# EAGLE design mm8_D016Aoshw (EAGLE 7.5.0)
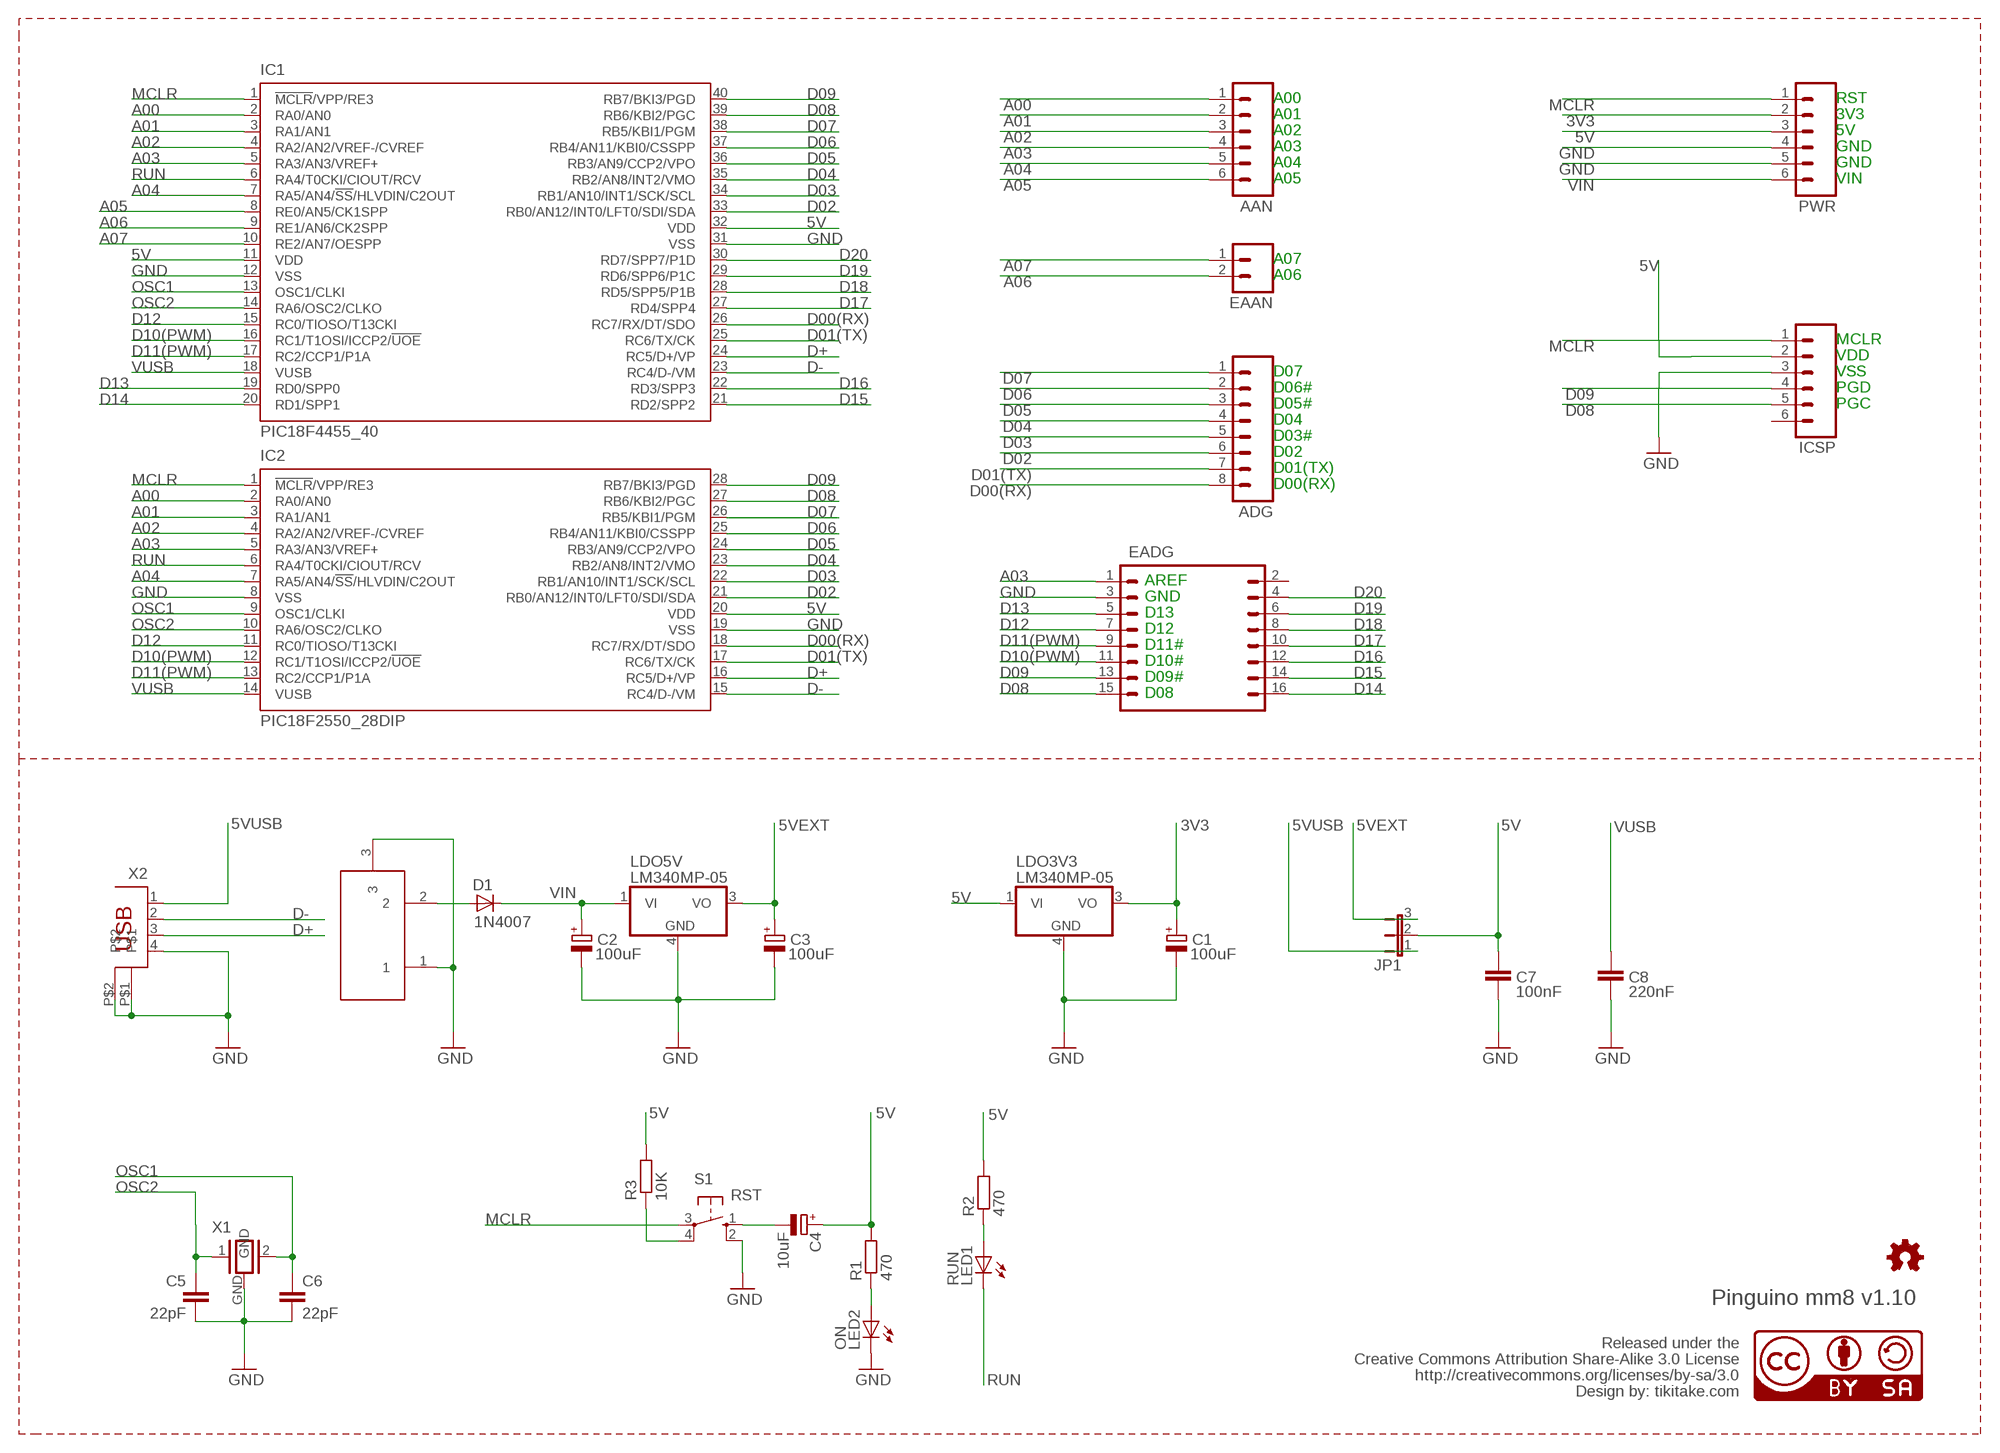
[diagram p0: schematic, sheet 1]

## Parts
AAN  M06SIP  [1X06]
ADG  M08  [1X08]
C1  100uF  CPOL-EUE2-5  [E2-5]
C2  100uF  CPOL-EUE2-5  [E2-5]
C3  100uF  CPOL-EUE2-5  [E2-5]
C4  10uF  CPOL-EUE2-5  [E2-5]
C5  22pF  C5/2.5N  [C5B2.5N]
C6  22pF  C5/2.5N  [C5B2.5N]
C7  100nF  C5/2.5N  [C5B2.5N]
C8  220nF  C5/2.5N  [C5B2.5N]
D1  1N4007  DIODE7  [DO41-7]
EAAN  M02PTH  [1X02]
EADG  M08X2  [2X8]
IC1  PIC18F4455_40  [DIL40]
IC2  PIC18F2550_28DIP  [DIL28-3]
ICSP  M06SIP  [1X06]
JP1  JP2E  [JP2]
LDO3V3  LM340MP-05  [SOT223]
LDO5V  LM340MP-05  [SOT223]
LED1  RUN  LED3MM  [LED3MM]
LED2  ON  LED3MM  [LED3MM]
LOGO1  OSHW_LOGO_FILLX0150-NT  [OSHW_FILLX150_NOTEXT]
PWR  M06SIP  [1X06]
R1  470  RESISTOR  [0207/7]
R2  470  RESISTOR  [0207/7]
R3  10K  RESISTOR  [0207/7]
S1  RST  10-XX  [B3F-10XX]
U$3  CC-BY-SA  [CC-BY-SA]
X1  RESONATOR  [QS3]
X2  PN61729  [PN61729]
X4  DC21MMX  [DC-21MM]

## Nets
3V3: C1.+ LDO3V3.3(VO) PWR.2
5V: C4.+ C7.1 IC1.11(VDD) IC1.32(VDD) IC2.20(VDD) ICSP.2 JP1.2 LDO3V3.1(VI) PWR.3 R1.2 R2.2 R3.2
5VEXT: C3.+ JP1.3 LDO5V.3(VO)
5VUSB: JP1.1 X2.1
A00: AAN.1 IC1.2(RA0/AN0) IC2.2(RA0/AN0)
A01: AAN.2 IC1.3(RA1/AN1) IC2.3(RA1/AN1)
A02: AAN.3 IC1.4(RA2/AN2/VREF-/CVREF) IC2.4(RA2/AN2/VREF-/CVREF)
A03: AAN.4 EADG.1 IC1.5(RA3/AN3/VREF+) IC2.5(RA3/AN3/VREF+)
A04: AAN.5 IC1.7(RA5/AN4/!SS!/HLVDIN/C2OUT) IC2.7(RA5/AN4/!SS!/HLVDIN/C2OUT)
A05: AAN.6 IC1.8(RE0/AN5/CK1SPP)
A06: EAAN.2 IC1.9(RE1/AN6/CK2SPP)
A07: EAAN.1 IC1.10(RE2/AN7/OESPP)
D00(RX): ADG.8 IC1.26(RC7/RX/DT/SDO) IC2.18(RC7/RX/DT/SDO)
D01(TX): ADG.7 IC1.25(RC6/TX/CK) IC2.17(RC6/TX/CK)
D02: ADG.6 IC1.33(RB0/AN12/INT0/LFT0/SDI/SDA) IC2.21(RB0/AN12/INT0/LFT0/SDI/SDA)
D03: ADG.5 IC1.34(RB1/AN10/INT1/SCK/SCL) IC2.22(RB1/AN10/INT1/SCK/SCL)
D04: ADG.4 IC1.35(RB2/AN8/INT2/VMO) IC2.23(RB2/AN8/INT2/VMO)
D05: ADG.3 IC1.36(RB3/AN9/CCP2/VPO) IC2.24(RB3/AN9/CCP2/VPO)
D06: ADG.2 IC1.37(RB4/AN11/KBI0/CSSPP) IC2.25(RB4/AN11/KBI0/CSSPP)
D07: ADG.1 IC1.38(RB5/KBI1/PGM) IC2.26(RB5/KBI1/PGM)
D08: EADG.15 IC1.39(RB6/KBI2/PGC) IC2.27(RB6/KBI2/PGC) ICSP.5
D09: EADG.13 IC1.40(RB7/BKI3/PGD) IC2.28(RB7/BKI3/PGD) ICSP.4
D10(PWM): EADG.11 IC1.16(RC1/T1OSI/ICCP2/!UOE) IC2.12(RC1/T1OSI/ICCP2/!UOE)
D11(PWM): EADG.9 IC1.17(RC2/CCP1/P1A) IC2.13(RC2/CCP1/P1A)
D12: EADG.7 IC1.15(RC0/TIOSO/T13CKI) IC2.11(RC0/TIOSO/T13CKI)
D13: EADG.5 IC1.19(RD0/SPP0)
D14: EADG.16 IC1.20(RD1/SPP1)
D15: EADG.14 IC1.21(RD2/SPP2)
D16: EADG.12 IC1.22(RD3/SPP3)
D17: EADG.10 IC1.27(RD4/SPP4)
D18: EADG.8 IC1.28(RD5/SPP5/P1B)
D19: EADG.6 IC1.29(RD6/SPP6/P1C)
D20: EADG.4 IC1.30(RD7/SPP7/P1D)
D+: IC1.24(RC5/D+/VP) IC2.16(RC5/D+/VP) X2.3
D-: IC1.23(RC4/D-/VM) IC2.15(RC4/D-/VM) X2.2
GND: C1.- C2.- C3.- C5.2 C6.2 C7.2 C8.2 EADG.3 IC1.12(VSS) IC1.31(VSS) IC2.8(VSS) IC2.19(VSS) ICSP.3 LDO3V3.4(GND) LDO5V.4(GND) LED2.K(C) PWR.4 PWR.5 S1.2(S1) X1.GND X2.4 X2.P$1 X2.P$2 X4.1 X4.3
MCLR: IC1.1(!MCLR!/VPP/RE3) IC2.1(!MCLR!/VPP/RE3) ICSP.1 PWR.1 S1.3(P)
N$1: LED2.A R1.1
N$2: R3.1 S1.4(P1)
N$3: D1.A X4.2
N$4: LED1.A R2.1
N$5: C4.- S1.1(S)
OSC1: C6.1 IC1.13(OSC1/CLKI) IC2.9(OSC1/CLKI) X1.2
OSC2: C5.1 IC1.14(RA6/OSC2/CLKO) IC2.10(RA6/OSC2/CLKO) X1.1
RUN: IC1.6(RA4/T0CKI/CIOUT/RCV) IC2.6(RA4/T0CKI/CIOUT/RCV) LED1.K(C)
VIN: C2.+ D1.C LDO5V.1(VI) PWR.6
VUSB: C8.1 IC1.18(VUSB) IC2.14(VUSB)
Unconnected: EADG.2 ICSP.6

## Notes on the sheet
- A00 | RST
- A01 | 3V3
- A02 | 5V
- A03 | GND
- A04 | GND
- A05 | VIN
- A07
- A06
- MCLR
- VDD
- D07 | VSS
- D06# | PGD
- D05# | PGC
- D04
- D03#
- D02
- D01(TX)
- D00(RX)
- AREF
- GND
- D13
- D12
- D11#
- D10#
- D09#
- D08
- Pinguino mm8 v1.10
- Released under the
- Creative Commons Attribution Share-Alike 3.0 License
- http://creativecommons.org/licenses/by-sa/3.0
- Design by: tikitake.com

## Library data of the parts
AAN ICSP PWR = mp8_001:M06: Header 6 Standard 6-pin 0.1" header. Use with straight break away headers (SKU : PRT-00116), right angle break away headers (PRT-00553), swiss pins (PRT-00743), machine pins (PRT-00117), and female headers (PRT-00115). Molex polarized connector foot print use with SKU : PRT-08094 with associated crimp pins and housings. NOTES ON THE VARIANTS LOCK and LOCK_LONGPADS... This footprint was designed to help hold the alignment of a through-hole component (i.e. 6-pin header) while soldering it into place. You may notice that each hole has been shifted either up or down by 0.005 of an inch from it's more standard position (which is a perfectly straight line). This slight alteration caused the pins (the squares in the middle) to touch the edges of the holes. Because they are alternating, it causes a "brace" to hold the component in place. 0.005 has proven to be the perfect amount of "off-center" position when using our standard breakaway headers. Although looks a little odd when you look at the bare footprint, once you have a header in there, the alteration is very hard to notice. Also, if you push a header all the way into place, it is covered up entirely on the bottom side. This idea of altering the position of holes to aid alignment will be further integrated into the Sparkfun Library for other footprints. It can help hold any component with 3 or more connection pins.
ADG = mp8_001:M08: Header 8 Standard 8-pin 0.1" header. Use with straight break away headers (SKU : PRT-00116), right angle break away headers (PRT-00553), swiss pins (PRT-00743), machine pins (PRT-00117), and female headers (PRT-00115).
C1-C3 = n00b0t_002:CPOL-EU: POLARIZED CAPACITOR, European symbol
C4 = n00b0t_004:CPOL-EU: POLARIZED CAPACITOR, European symbol
C5 C6 = n00b0t_004:C: WIMA CAPACITOR naming: grid - package width
C7 C8 = n00b0t_002:C: WIMA CAPACITOR naming: grid - package width
D1 = mm8_001:DIODE: DIODE general purpose rectifier, 1 A
EAAN = mp8_001:M02: Header 2 Standard 2-pin 0.1" header. Use with straight break away headers (SKU : PRT-00116), right angle break away headers (PRT-00553), swiss pins (PRT-00743), machine pins (PRT-00117), and female headers (PRT-00115). Molex polarized connector foot print use with SKU : PRT-08233 with associated crimp pins and housings.
EADG = mm8_001:M08X2
IC1 = p8aff_001:PIC18F4*_40: USB Microcontrollers with nanoWatt Technology High-Performance, Enhanced Flash, 28/40/44-Pin, Source: http://ww1.microchip.com/downloads/en/devicedoc/39632c.pdf
IC2 = p8aff_001:PIC18F2*_28: USB Microcontrollers with nanoWatt Technology High-Performance, Enhanced Flash, 28/40/44-Pin, Source: http://ww1.microchip.com/downloads/en/devicedoc/39632c.pdf
JP1 = mm8_001:JP2E: JUMPER
LDO3V3 LDO5V = mm8_001:LM340?-*: Positive VOLTAGE REGULATOR Source: http://cache.national.com/ds/LM/LM340.pdf
LED1 LED2 = n00b0t_004:LED
LOGO1 = tikitake_002:OSHW_LOGO_FILL
R1-R3 = n00b0t_004:RESISTOR
S1 = n00b0t_004:10-XX: OMRON SWITCH
U$3 = n00b0t_004:CC-BY-SA
X1 = special:RESONATOR
X2 = SmartPrj:PN61729: BERG USB connector
X4 = powersupply:DC21MM

## Net classes
0 default: width 0.152 mm, drill 0.305 mm, clearance 0.152 mm
1 power: width 0.61 mm, drill 0.508 mm, clearance 0.152 mm
2 gnd: width 0.305 mm, drill 0.508 mm, clearance 0.152 mm
3 usbvcc: width 0.508 mm, drill 0.508 mm, clearance 0.152 mm

## Board
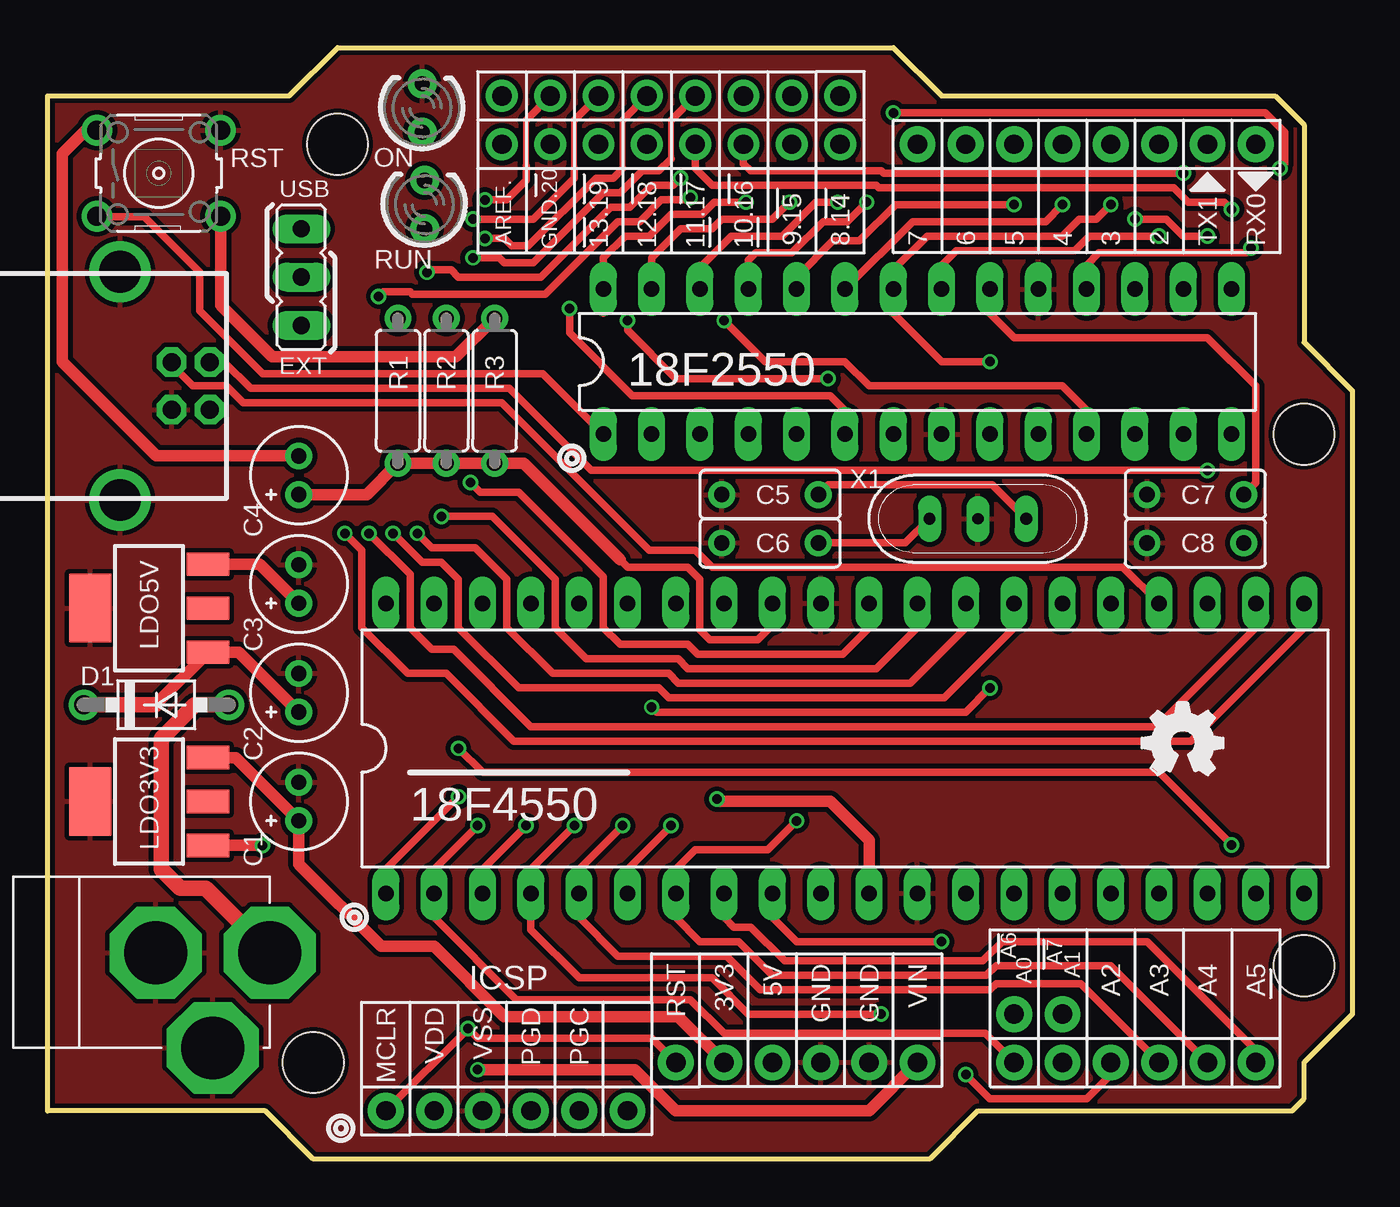
[diagram p1: board, top side]
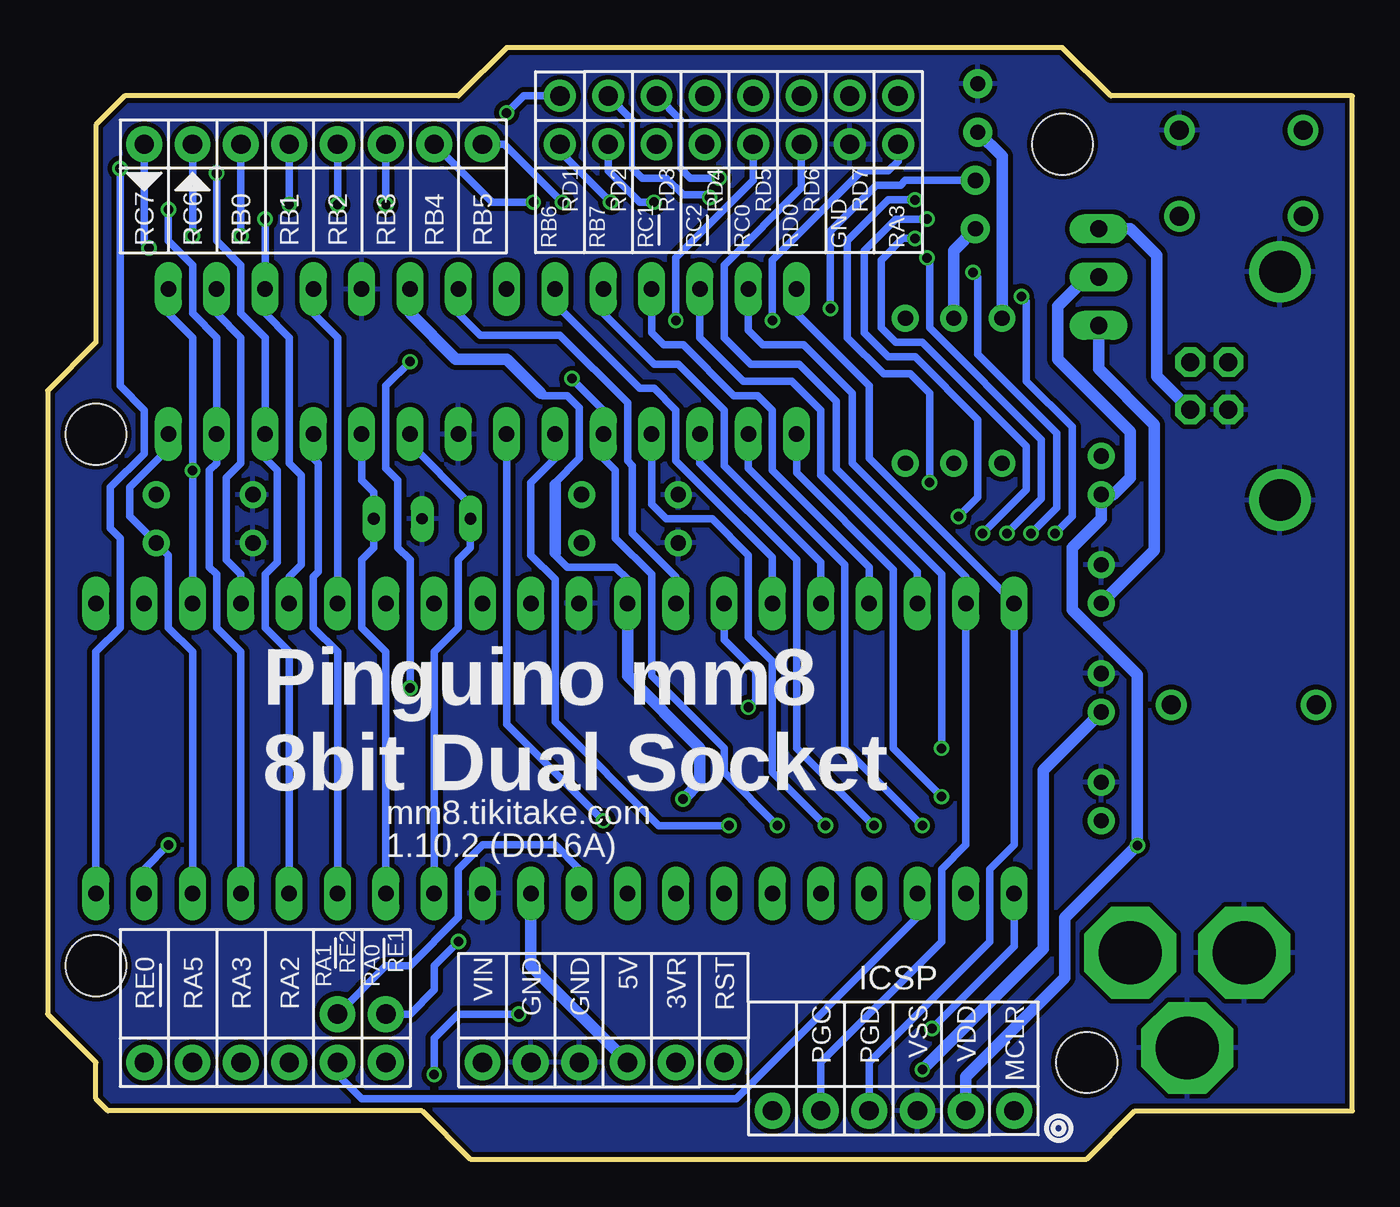
[diagram p2: board, bottom side, seen from below]

Size 68.58 x 58.42 mm. Coordinates in mm from the lower left corner, seen from the top.
Outline: 12.7,55.88 15.24,58.42 44.45,58.42 46.99,55.88 64.52,55.88 66.04,54.36 66.04,42.93 68.58,40.39 68.58,7.62 66.04,5.08 66.04,3.17 65.41,2.54 48.9,2.54 46.35,0 13.97,0 11.43,2.54 0,2.54 0,55.88 12.7,55.88
Copper layers (1*16): Top 0.035mm / dielectric 1.5mm / Bottom 0.035mm
Design rules "mm8_B001 *": minimum track width 8mil, minimum drill 12mil, track to track 10mil, track to pad 10mil, pad to pad 10mil, via to via 10mil, smd to smd 0mil, copper to edge 10mil, drill to drill 10mil, minimum pad ring 12mil, minimum via ring 6mil, stop-mask expansion 2mil, vias tented up to drill 25mil, thermal gap 10mil
Holes 3.2 mm at 66.04,38.1 66.04,10.16 15.24,53.34 13.97,5.08

### Footprints (pad centres in the part's own frame; a part is rotated, then mirrored left to right if it is on the bottom)
1X06 = drill 1.016 pad 1.88: 1 0,0; 2 2.54,0; 3 5.08,0; 4 7.62,0; 5 10.16,0; 6 12.7,0
1X08 = drill 1.016 pad 1.88: 1 0,0; 2 2.54,0; 3 5.08,0; 4 7.62,0; 5 10.16,0; 6 12.7,0; 7 15.24,0; 8 17.78,0
E2-5 = drill 0.8: + -1.016,0; - 1.016,0
C5B2.5N = drill 0.8: 1 -2.54,0; 2 2.54,0
DO41-7 = drill 1: A 3.81,0; C -3.81,0
1X02 = drill 1.016 pad 1.88: 1 0,0; 2 2.54,0
2X8 = drill 1.016 pad 1.676: 1 0,0; 2 0,2.54; 3 2.54,0; 4 2.54,2.54; 5 5.08,0; 6 5.08,2.54; 7 7.62,0; 8 7.62,2.54; 9 10.16,0; 10 10.16,2.54; 11 12.7,0; 12 12.7,2.54; 13 15.24,0; 14 15.24,2.54; 15 17.78,0; 16 17.78,2.54
DIL40 = drill 0.813 long: 1 -24.13,-7.62; 2 -21.59,-7.62; 3 -19.05,-7.62; 4 -16.51,-7.62; 5 -13.97,-7.62; 6 -11.43,-7.62; 7 -8.89,-7.62; 8 -6.35,-7.62; 9 -3.81,-7.62; 10 -1.27,-7.62; 11 1.27,-7.62; 12 3.81,-7.62; 13 6.35,-7.62; 14 8.89,-7.62; 15 11.43,-7.62; 16 13.97,-7.62; 17 16.51,-7.62; 18 19.05,-7.62; 19 21.59,-7.62; 20 24.13,-7.62; 21 24.13,7.62; 22 21.59,7.62; 23 19.05,7.62; 24 16.51,7.62; 25 13.97,7.62; 26 11.43,7.62; 27 8.89,7.62; 28 6.35,7.62; 29 3.81,7.62; 30 1.27,7.62; 31 -1.27,7.62; 32 -3.81,7.62; 33 -6.35,7.62; 34 -8.89,7.62; 35 -11.43,7.62; 36 -13.97,7.62; 37 -16.51,7.62; 38 -19.05,7.62; 39 -21.59,7.62; 40 -24.13,7.62
DIL28-3 = drill 0.813 long: 1 -16.51,-3.81; 2 -13.97,-3.81; 3 -11.43,-3.81; 4 -8.89,-3.81; 5 -6.35,-3.81; 6 -3.81,-3.81; 7 -1.27,-3.81; 8 1.27,-3.81; 9 3.81,-3.81; 10 6.35,-3.81; 11 8.89,-3.81; 12 11.43,-3.81; 13 13.97,-3.81; 14 16.51,-3.81; 15 16.51,3.81; 16 13.97,3.81; 17 11.43,3.81; 18 8.89,3.81; 19 6.35,3.81; 20 3.81,3.81; 21 1.27,3.81; 22 -1.27,3.81; 23 -3.81,3.81; 24 -6.35,3.81; 25 -8.89,3.81; 26 -11.43,3.81; 27 -13.97,3.81; 28 -16.51,3.81
JP2 = drill 0.914 long: 1 -2.54,0; 2 0,0; 3 2.54,0
SOT223 = smd 1.219 x 2.235: 1 -2.311,-3.099; 2 0,-3.099; 3 2.311,-3.099 | smd 3.6 x 2.2: 4 0,3.099
LED3MM = drill 0.8 pad 1.524: A -1.27,0; K 1.27,0
0207/7 = drill 0.8: 1 -3.81,0; 2 3.81,0
B3F-10XX = drill 1: 1 -3.251,2.261; 2 3.251,2.261; 3 -3.251,-2.261; 4 3.251,-2.261
QS3 = drill 0.61 long: 1 -2.54,0; 2 2.54,0 | drill 0.6 long: GND 0,0
PN61729 = drill 0.95 octagon: 1 1.25,4.71; 2 -1.25,4.71; 3 -1.25,2.71; 4 1.25,2.71 | drill 2.2: P$1 -6,0; P$2 6,0
DC-21MM = drill 3.302 pad 4.826 octagon: 1 -5.08,-3.353; 2 -0.076,-6.35; 3 -0.076,-0.356

### Placement (x,y rotation side)
AAN  50.8,5.08 0 top
ADG  45.72,53.34 0 top
C1  13.21,18.8 90 top
C2  13.21,24.51 90 top
C3  13.21,30.23 90 top
C4  13.21,35.94 90 top
C5  37.97,34.92 180 top
C6  37.97,32.38 180 top
C7  60.33,34.92 180 top
C8  60.33,32.38 180 top
D1  5.71,23.88 0 top
EAAN  53.34,7.62 180 top
EADG  23.88,53.34 0 top
IC1  41.91,21.59 0 top
IC2  45.72,41.91 0 top
ICSP  17.78,2.54 0 top
JP1  13.34,46.35 270 top
LDO3V3  5.33,18.8 90 top
LDO5V  5.33,28.96 90 top
LED1  19.81,50.16 90 top
LED2  19.68,55.24 90 top
LOGO1  57.53,20.19 0 top
PWR  33.02,5.08 0 top
R1  18.41,40.39 270 top
R2  20.95,40.39 270 top
R3  23.5,40.39 270 top
S1  5.84,51.82 0 top
U$3  11.43,-10.16 0 top  (outside the outline)
X1  48.9,33.66 180 top
X2  3.81,40.64 270 top
X4  5.33,10.92 90 top

### Tracks (layer width: path | path; a pad name or v marks a point on that pad's centre or on a via)
3V3
  Top 0.61: PWR.2 33.15,7.49 24,7.49 20.32,11.18 17.53,11.18 13.21,15.49 C1.+ 9.88,21.11 LDO3V3.3
5V  (via drill 0.5)
  Top 0.406: IC2.20 49.53,44.45 50.8,43.18 60.96,43.18 63.5,40.64 63.5,35.56 C7.1 | 30.1,31.5 30.48,31.11 33.66,31.11 34.29,30.48 34.29,27.81 34.8,27.3 37.34,27.3 38.1,28.07
  Top 0.61: v11.3,16.48 LDO3V3.1 | C4.+ 16.76,34.92 R1.2 R2.2 R3.2 25.02,36.58 30.1,31.5 | 38.1,28.07 IC1.32 | v35.18,18.92 35.31,18.8 41.15,18.8 43.18,16.76 IC1.11
  Bottom 0.406: IC1.32 38.1,30.48 38.73,31.11 41.27,31.11 41.91,31.75 41.91,31.88 | 41.91,35.43 41.91,35.56 40.64,36.83 40.64,39.5 41.27,40.13 42.55,40.13 42.67,40.26
  Bottom 0.61: ICSP.2 20.32,4.32 15.11,9.53 15.11,12.68 v11.3,16.48 11.3,25.45 14.73,28.88 14.73,32.13 13.21,33.66 C4.+ 12.57,34.92 11.68,35.81 11.68,38.23 15.49,42.04 15.49,44.83 13.97,46.35 JP1.2 | PWR.3 43.18,10.16 IC1.11 | 41.91,31.88 41.91,35.43 | 42.67,40.26 44.45,42.04 47.12,42.04 49.53,44.45 IC2.20 | IC1.32 38.1,25.4 34.29,21.59 34.29,19.81 v35.18,18.92
5VEXT
  Top 0.61: C3.+ 11.15,31.27 LDO5V.3
  Bottom 0.61: JP1.3 13.34,41.53 10.41,38.61 10.41,32 C3.+
5VUSB
  Bottom 0.61: X2.1 10.29,41.15 10.29,47.5 11.68,48.89 JP1.1
A00  (via drill 0.5)
  Top 0.406: AAN.1 49.28,6.6 35.56,6.6 33.78,8.38 24.64,8.38 20.32,12.7 IC1.2 20.32,15.24 v22.61,17.53
  Bottom 0.406: IC2.2 31.75,36.32 26.67,31.24 26.67,21.59 v22.61,17.53
A01  (via drill 0.5)
  Top 0.406: v25.15,17.53 22.86,15.24 IC1.3
  Bottom 0.406: IC2.3 34.29,36.58 29.21,31.5 29.21,21.59 v25.15,17.53 | IC1.3 22.86,12.7 32.38,3.17 52.07,3.17 53.34,4.45 AAN.2
A02  (via drill 0.5)
  Top 0.406: v27.69,17.53 25.4,15.24 IC1.4 25.4,12.07 27.94,9.53 34.92,9.53 36.83,7.62 v43.81,7.62 | AAN.3 55.88,4.45 54.61,3.17 49.53,3.17 v48.26,4.45
  Bottom 0.406: IC2.4 36.83,34.42 36.07,33.66 33.66,33.66 31.75,31.75 31.75,27.43 30.48,26.16 30.48,20.32 v27.69,17.53 | v48.26,4.45 48.26,6.35 46.99,7.62 v43.81,7.62
A03  (via drill 0.5)
  Top 0.406: v30.23,17.53 27.94,15.24 IC1.5 27.94,12.7 29.97,10.67 35.69,10.67 37.47,8.89 49.53,8.89 49.85,9.21 54.29,9.21 AAN.4 | v30.48,44.07 30.48,43.56 33.02,41.02 v41.02,41.02
  Bottom 0.406: v30.23,17.53 33.02,20.32 33.02,21.59 36.83,25.4 36.83,30.73 38.73,32.64 38.73,36.2 39.37,36.83 IC2.5 39.37,39.37 v41.02,41.02 | EADG.1 23.88,52.45 24.38,51.94 25.78,51.94 30.48,47.24 v30.48,44.07
A04  (via drill 0.5)
  Top 0.406: v39.37,17.78 37.85,16.26 34.04,16.26 33.02,15.24 IC1.7 33.02,12.7 34.29,11.43 36.32,11.43 38.1,9.65 49.34,9.65 49.85,10.16 55.88,10.16 AAN.5
  Bottom 0.406: IC2.7 44.45,22.86 v39.37,17.78
A05
  Top 0.406: IC1.8 35.56,12.7 36.07,12.19 36.96,12.19 38.73,10.41 49.15,10.41 50.16,11.43 57.78,11.43 63.5,5.71 AAN.6
A06  (via drill 0.5)
  Top 0.406: IC1.9 38.1,12.7 39.37,11.43 v46.99,11.43
  Bottom 0.406: v46.99,11.43 48.26,10.16 48.26,8.89 49.53,7.62 EAAN.2
A07
  Bottom 0.406: EAAN.1 50.8,10.16 49.53,10.16 46.99,12.7 46.99,15.24 45.72,16.51 41.91,16.51 40.64,15.24 IC1.10
D00(RX)  (via drill 0.5)
  Top 0.406: IC2.18 54.61,46.99 55.24,47.62 62.99,47.62 v63.25,47.88
  Bottom 0.406: v63.25,47.88 63.5,48.13 ADG.8 | IC1.26 53.34,43.18 54.61,44.45 IC2.18
D01(TX)  (via drill 0.5)
  Top 0.406: v57.15,49.4 58.8,49.4 59.69,48.51 v60.96,48.51
  Bottom 0.406: v57.15,49.4 IC2.17 57.15,44.45 55.88,43.18 55.88,36.58 55.24,35.94 55.24,31.24 55.88,30.61 IC1.25 | v60.96,48.51 ADG.7
D02  (via drill 0.5)
  Top 0.406: IC2.21 46.99,46.99 47.75,47.75 53.98,47.75 54.74,48.51 v58.42,48.51
  Bottom 0.406: v58.42,48.51 ADG.6 | IC1.33 35.56,30.61 37.85,32.89 37.85,36.45 38.1,36.7 38.1,39.75 41.66,43.31 45.85,43.31 46.99,44.45 IC2.21
D03  (via drill 0.5)
  Top 0.406: v55.88,50.16 55.12,49.4 54.23,49.4 53.34,48.51 46.23,48.51 44.45,46.74 IC2.22 44.45,44.45 46.99,41.91 v49.53,41.91 | v31.75,23.75 32,23.49 48.26,23.49 v49.53,24.77
  Bottom 0.406: v55.88,50.16 ADG.5 | IC1.34 33.02,27.3 31.37,25.65 31.37,24.13 v31.75,23.75 | v49.53,24.77 49.53,31.5 50.16,32.13 50.16,35.69 50.8,36.32 50.8,40.64 v49.53,41.91
D04  (via drill 0.5)
  Top 0.406: IC2.23 45.47,49.28 52.45,49.28 v53.34,50.16
  Bottom 0.406: v53.34,50.16 ADG.4 | IC1.35 30.48,31.62 35.56,36.7 35.56,39.37 36.7,40.51 37.47,40.51 41.91,44.96 IC2.23
D05  (via drill 0.5)
  Top 0.406: IC2.24 39.37,46.35 41.27,48.26 42.67,48.26 44.58,50.16 v50.8,50.16
  Bottom 0.406: IC1.36 27.94,31.37 33.02,36.45 33.02,39.37 35.43,41.78 36.7,41.78 39.37,44.45 IC2.24 | v50.8,50.16 ADG.3
D06  (via drill 0.5)
  Top 0.406: IC2.25 36.83,47.24 37.21,47.62 39.12,47.62 40.77,49.28 42.04,49.28 v43.05,50.29
  Bottom 0.406: IC1.37 25.4,31.11 30.48,36.2 30.48,39.37 31.24,40.13 32.51,40.13 35.18,42.8 36.2,42.8 36.83,43.43 IC2.25 | v43.05,50.29 45.21,50.29 ADG.2
D07  (via drill 0.5)
  Top 0.406: IC2.26 34.29,46.99 34.42,46.99 35.94,48.51 38.61,48.51 40.39,50.29 v41.53,50.29
  Bottom 0.406: IC1.38 22.86,30.86 27.94,35.94 27.94,39.37 29.46,40.89 32,40.89 34.29,43.18 IC2.26 | v41.53,50.29 44.58,53.34 ADG.1
D08  (via drill 0.5)
  Top 0.406: IC2.27 31.75,47.37 33.27,48.89 34.92,48.89 35.43,49.4 38.1,49.4 v38.99,50.29
  Bottom 0.406: ICSP.5 27.94,5.08 21.59,11.43 21.59,15.24 20.32,16.51 IC1.39 20.32,30.61 26.29,36.58 26.29,40.26 28.83,42.8 30.99,42.8 31.75,43.56 IC2.27 | v38.99,50.29 41.66,52.96 EADG.15
D09  (via drill 0.5)
  Top 0.406: 29.21,44.45 IC2.28 29.21,47.37 30.35,48.51 31.62,48.51 32.77,49.66 34.42,49.66 35.05,50.29 v36.7,50.29
  Bottom 0.406: ICSP.4 25.4,5.08 19.05,11.43 19.05,15.24 17.78,16.51 IC1.40 25.4,36.83 25.4,40.64 29.21,44.45 IC2.28 | v36.7,50.29 37.47,50.29 39.12,51.94 EADG.13
D10(PWM)  (via drill 0.51)
  Top 0.406: EADG.11 36.58,52.32 36.96,51.94 43.81,51.94 43.94,51.82 v59.69,51.82
  Bottom 0.406: IC1.16 55.88,26.67 57.15,27.94 57.15,30.73 56.52,31.37 56.52,36.2 57.15,36.83 IC2.12 57.15,43.18 58.42,44.45 58.42,46.99 59.69,48.26 v59.69,51.82
D11(PWM)  (via drill 0.5)
  Top 0.406: EADG.9 34.04,52.07 34.92,51.18 43.56,51.18 43.69,51.05 59.18,51.05 59.94,50.29 61.85,50.29 v62.23,49.91
  Bottom 0.406: IC1.17 58.42,26.67 59.69,27.94 59.69,30.73 60.07,31.11 60.07,36.2 59.69,36.58 IC2.13 59.69,43.18 60.96,44.45 60.96,46.99 62.23,48.26 v62.23,49.91
D12  (via drill 0.5)
  Top 0.406: IC2.11 54.61,39.37 53.34,40.64 43.18,40.64 41.91,41.91 37.72,41.91 v35.56,44.07
  Bottom 0.406: IC1.15 53.34,26.67 54.61,27.94 54.61,30.61 54.36,30.86 54.36,36.58 54.61,36.83 IC2.11 | v35.56,44.07 35.56,47.37 31.5,51.44 EADG.7
D13  (via drill 0.5)
  Top 0.406: v62.23,16.51 58.42,20.32 22.86,20.32 v21.59,21.59
  Bottom 0.406: IC1.19 63.5,15.24 v62.23,16.51 | EADG.5 28.96,51.05 33.02,46.99 33.02,43.18 31.62,41.78 29.08,41.78 27.13,39.83 27.13,36.27 21.59,30.73 v21.59,21.59
D14  (via drill 0.5)
  Top 0.406: v64.77,52.07 65.02,52.32 65.02,53.98 64.01,54.99 v44.45,54.99
  Bottom 0.406: EADG.16 43.56,55.88 v44.45,54.99 | IC1.20 66.04,26.67 64.77,27.94 64.77,32.64 65.28,33.15 65.28,35.31 63.5,37.08 63.5,39.37 64.77,40.64 v64.77,52.07
D15  (via drill 0.5)
  Top 0.406: v33.78,50.55 33.66,50.42 32.26,50.42 31.11,49.28 29.97,49.28 26.16,45.47 19.18,45.47 19.05,45.59 17.65,45.59 v17.4,45.34 | IC1.21 66.04,27.94 60.07,21.97 24.51,21.97 20.95,25.53 18.92,25.53 16.51,27.94 16.51,32 v15.62,32.89
  Bottom 0.305: 37.85,52.07 37.85,54.61
  Bottom 0.406: 37.85,54.61 EADG.14 | v33.78,50.55 33.91,50.67 35.18,50.67 36.07,51.56 37.34,51.56 37.85,52.07 | v17.4,45.34 17.14,45.09 17.14,40.89 14.73,38.48 14.73,33.78 v15.62,32.89
D16  (via drill 0.5)
  Top 0.406: v33.27,51.56 32.89,51.18 31.75,51.18 30.61,50.04 29.59,50.04 25.91,46.35 21.59,46.35 21.21,46.74 20.07,46.74 v19.94,46.61 | IC1.22 63.5,27.94 58.29,22.73 25.4,22.73 21.34,26.8 20.19,26.8 19.05,27.94 19.05,30.73 v16.89,32.89
  Bottom 0.305: 35.31,52.07 35.31,54.61
  Bottom 0.406: 35.31,54.61 EADG.12 | v33.27,51.56 34.8,51.56 35.31,52.07 | v16.89,32.89 15.54,34.24 15.54,38.15 19.68,42.29 19.68,46.35 v19.94,46.61
D17  (via drill 0.5)
  Top 0.305: 32.77,52.58 32.77,54.61
  Top 0.406: 32.77,54.61 EADG.10 | IC1.27 50.8,27.94 47.12,24.26 32.64,24.26 32.13,24.77 24.77,24.77 21.59,27.94 21.59,30.48 20.7,31.37 19.68,31.37 v18.16,32.89 | 32.77,52.58 32.13,51.94 31.24,51.94 30.1,50.8 29.21,50.8 25.53,47.12 24,47.12 23.75,47.37 v22.35,47.37
  Bottom 0.406: v22.35,47.37 22.23,47.24 22.23,43.69 16.36,37.82 16.36,34.7 v18.16,32.89
D18  (via drill 0.5)
  Top 0.305: 30.23,52.07 30.23,54.61
  Top 0.406: 30.23,54.61 EADG.8 | IC1.28 48.26,27.94 45.34,25.02 33.15,25.02 32.64,25.53 26.54,25.53 24.13,27.94 24.13,30.48 22.48,32.13 20.19,32.13 v19.43,32.89 | 30.23,52.07 29.72,51.56 28.83,51.56 25.27,48.01 24.38,48.01 24,48.39 v22.99,48.39
  Bottom 0.406: v19.43,32.89 17.14,35.18 17.14,37.46 22.61,42.93 24,42.93 24.77,43.69 24.77,47.24 23.62,48.39 v22.99,48.39
D19  (via drill 0.5)
  Top 0.305: 27.69,52.07 27.69,54.61
  Top 0.406: 27.69,54.61 EADG.6 | IC1.29 45.72,27.94 43.56,25.78 33.66,25.78 33.15,26.29 28.32,26.29 26.67,27.94 26.67,30.48 23.37,33.78 v20.7,33.78 | 27.69,52.07 27.69,51.56 25.53,49.4 v22.35,49.4
  Bottom 0.406: v22.35,49.4 24,49.4 25.65,47.75 25.65,43.43 24.38,42.16 22.99,42.16 19.68,38.86 19.68,34.8 v20.7,33.78
D20  (via drill 0.5)
  Top 0.305: 25.15,52.2 25.15,54.61
  Top 0.406: 25.15,52.2 25.15,51.44 24.13,50.42 v22.99,50.42 | 25.15,54.61 EADG.4 | IC1.30 43.18,27.94 41.78,26.54 34.16,26.54 33.66,27.05 30.1,27.05 29.21,27.94 29.21,30.61 24.77,35.05 22.73,35.05 v22.23,35.56
  Bottom 0.406: v22.99,50.42 24.38,50.42 26.54,48.26 26.54,43.18 24.64,41.27 23.24,41.27 22.23,40.26 v22.23,35.56
D+
  Top 0.406: X2.3 6.52,41.74 7.62,40.64 9.4,40.64 10.29,39.75 23.88,39.75 31.62,32 34.04,32 34.92,31.11 56.52,31.11 IC1.24
  Bottom 0.406: IC2.16 59.69,44.45 58.42,43.18 58.42,36.58 59.18,35.81 59.18,31.5 58.42,30.73 IC1.24
D-  (via drill 0.5)
  Top 0.406: X2.2 9.29,41.89 10.67,40.51 24.26,40.51 28.57,36.2 v60.96,36.2
  Bottom 0.406: IC2.15 62.23,44.45 60.96,43.18 v60.96,36.2 IC1.23
GND
  pour Bottom (rank 2): -0.64,59.05 69.22,59.05 69.22,-0.63 -0.64,-0.63 -0.64,33.66 -0.64,47.62
  pour Top (rank 2): -0.64,59.05 69.22,59.05 69.22,-0.63 -0.64,-0.63 -0.64,33.66 -0.64,47.62
MCLR  (via drill 0.5)
  Top 0.406: IC2.1 26.04,41.27 11.3,41.27 8,44.58 8,46.61 5.08,49.53 2.62,49.53 | v21.59,19.05 17.78,15.24 IC1.1 | PWR.1 31.75,6.35 22.61,6.35 v22.1,6.86 ICSP.1
  Top 0.61: 2.62,49.53 S1.3
  Bottom 0.406: IC2.1 29.21,36.07 24.13,30.99 24.13,21.59 v21.59,19.05 | IC1.1 17.78,11.18 v22.1,6.86
N$1
  Bottom 0.61: R1.1 18.41,52.7 LED2.A
N$2
  Top 0.61: S1.4 9.09,44.88 11.81,42.16 21.46,42.16 R3.1
N$3
  Top 0.813: D1.A 7.75,23.88 5.97,22.1 5.97,15.24 6.99,14.22 8.31,14.22 X4.2
N$4
  Bottom 0.61: LED1.A 20.95,47.75 R2.1
N$5
  Top 0.61: S1.1 2.01,54.08 0.76,52.83 0.76,41.91 5.71,36.96 C4.-
OSC1
  Top 0.406: C6.1 45.09,32.38 X1.2
  Bottom 0.406: IC2.9 49.53,37.59 46.35,34.42 X1.2 46.35,32.13 46.99,31.5 46.99,27.94 48.26,26.67 IC1.13
OSC2
  Top 0.406: C5.1 41.02,35.43 49.66,35.43 X1.1
  Bottom 0.406: IC1.14 50.8,26.67 52.07,27.94 52.07,31.5 51.44,32.13 X1.1 51.44,35.05 52.07,35.69 IC2.10
RUN  (via drill 0.5)
  Top 0.406: v27.43,44.7 27.43,43.43 30.73,40.13 41.15,40.13 41.91,39.37 IC2.6 | v32.77,17.53 30.48,15.24 IC1.6
  Bottom 0.406: LED1.K 23.5,51.44 23.75,51.18 25.02,51.18 27.43,48.77 v27.43,44.7 | IC2.6 41.91,36.83 43.18,35.56 43.18,31.75 41.91,30.48 41.91,22.99 36.45,17.53 v32.77,17.53
VIN  (via drill 0.5)
  Top 0.61: 5.66,23.88 LDO5V.1 10.06,26.64 C2.+ | v22.61,4.7 30.86,4.7 33.02,2.54 43.18,2.54 PWR.6
  Top 0.813: D1.C 5.66,23.88
  Bottom 0.61: C2.+ 16.26,20.45 16.26,11.05 v22.61,4.7
VUSB
  Bottom 0.406: IC1.18 60.96,26.67 62.23,27.94 62.23,31.75 C8.1 64.26,33.78 64.26,35.31 62.23,37.34 IC2.14

### Text on the board
tPlace: RST | ON | USB | AREF. | GND.20 | 13.19 | 12.18 | 11.17 | 10.16 | 9.15 | 8.14 | 7 | 6 | 5 | 4 | 3 | 2 | TX1 | RX0 | RUN | EXT | 18F2550 | LDO5V | 18F4550 | LDO3V3 | RST | 3V3 | 5V | GND | GND | VIN | A0 | A6 | A7 | A1 | A2 | A3 | A4 | A5 | ICSP | MCLR | VDD | VSS | PGD | PGC
bPlace: RD7 | RD6 | RD5 | RD4 | RD3 | RD2 | RD1 | RA3 | GND | RD0 | RC0 | RC2 | RC1 | RB7 | RB6 | RB5 | RB4 | RB3 | RB2 | RB1 | RB0 | RC6 | RC7 | Pinguino mm8 / 8bit Dual Socket | mm8.tikitake.com | 1.10.2 (D016A) | RE1 | RA0 | RE2 | RA1 | RST | 3VR | 5V | GND | GND | VIN | RA2 | RA3 | RA5 | RE0 | MCLR | VDD | VSS | PGD | ICSP | PGC
tValues: Released under the Creative Commons Attribution Share-Alike 3.0 License | http://creativecommons.org/licenses/by-sa/3.0 | Designed by: tikitake.com and modified by AleGar (alegorico) | Reference Designs ARE PROVIDED "AS IS" AND "WITH ALL FAULTS". | Project site: mm8.tikitake.com
214bmp: D:/SmartProjects/Snc/a4_bn_logo2.bmp